# Altium schematic sheet Sheet2.SchDoc
size A3; SheetNumber: 1; SheetTotal: 1; SPICEModelCacheBHSTCHFE: <root> / <DocumentId>BHSTCHFE</DocumentId> / </root>
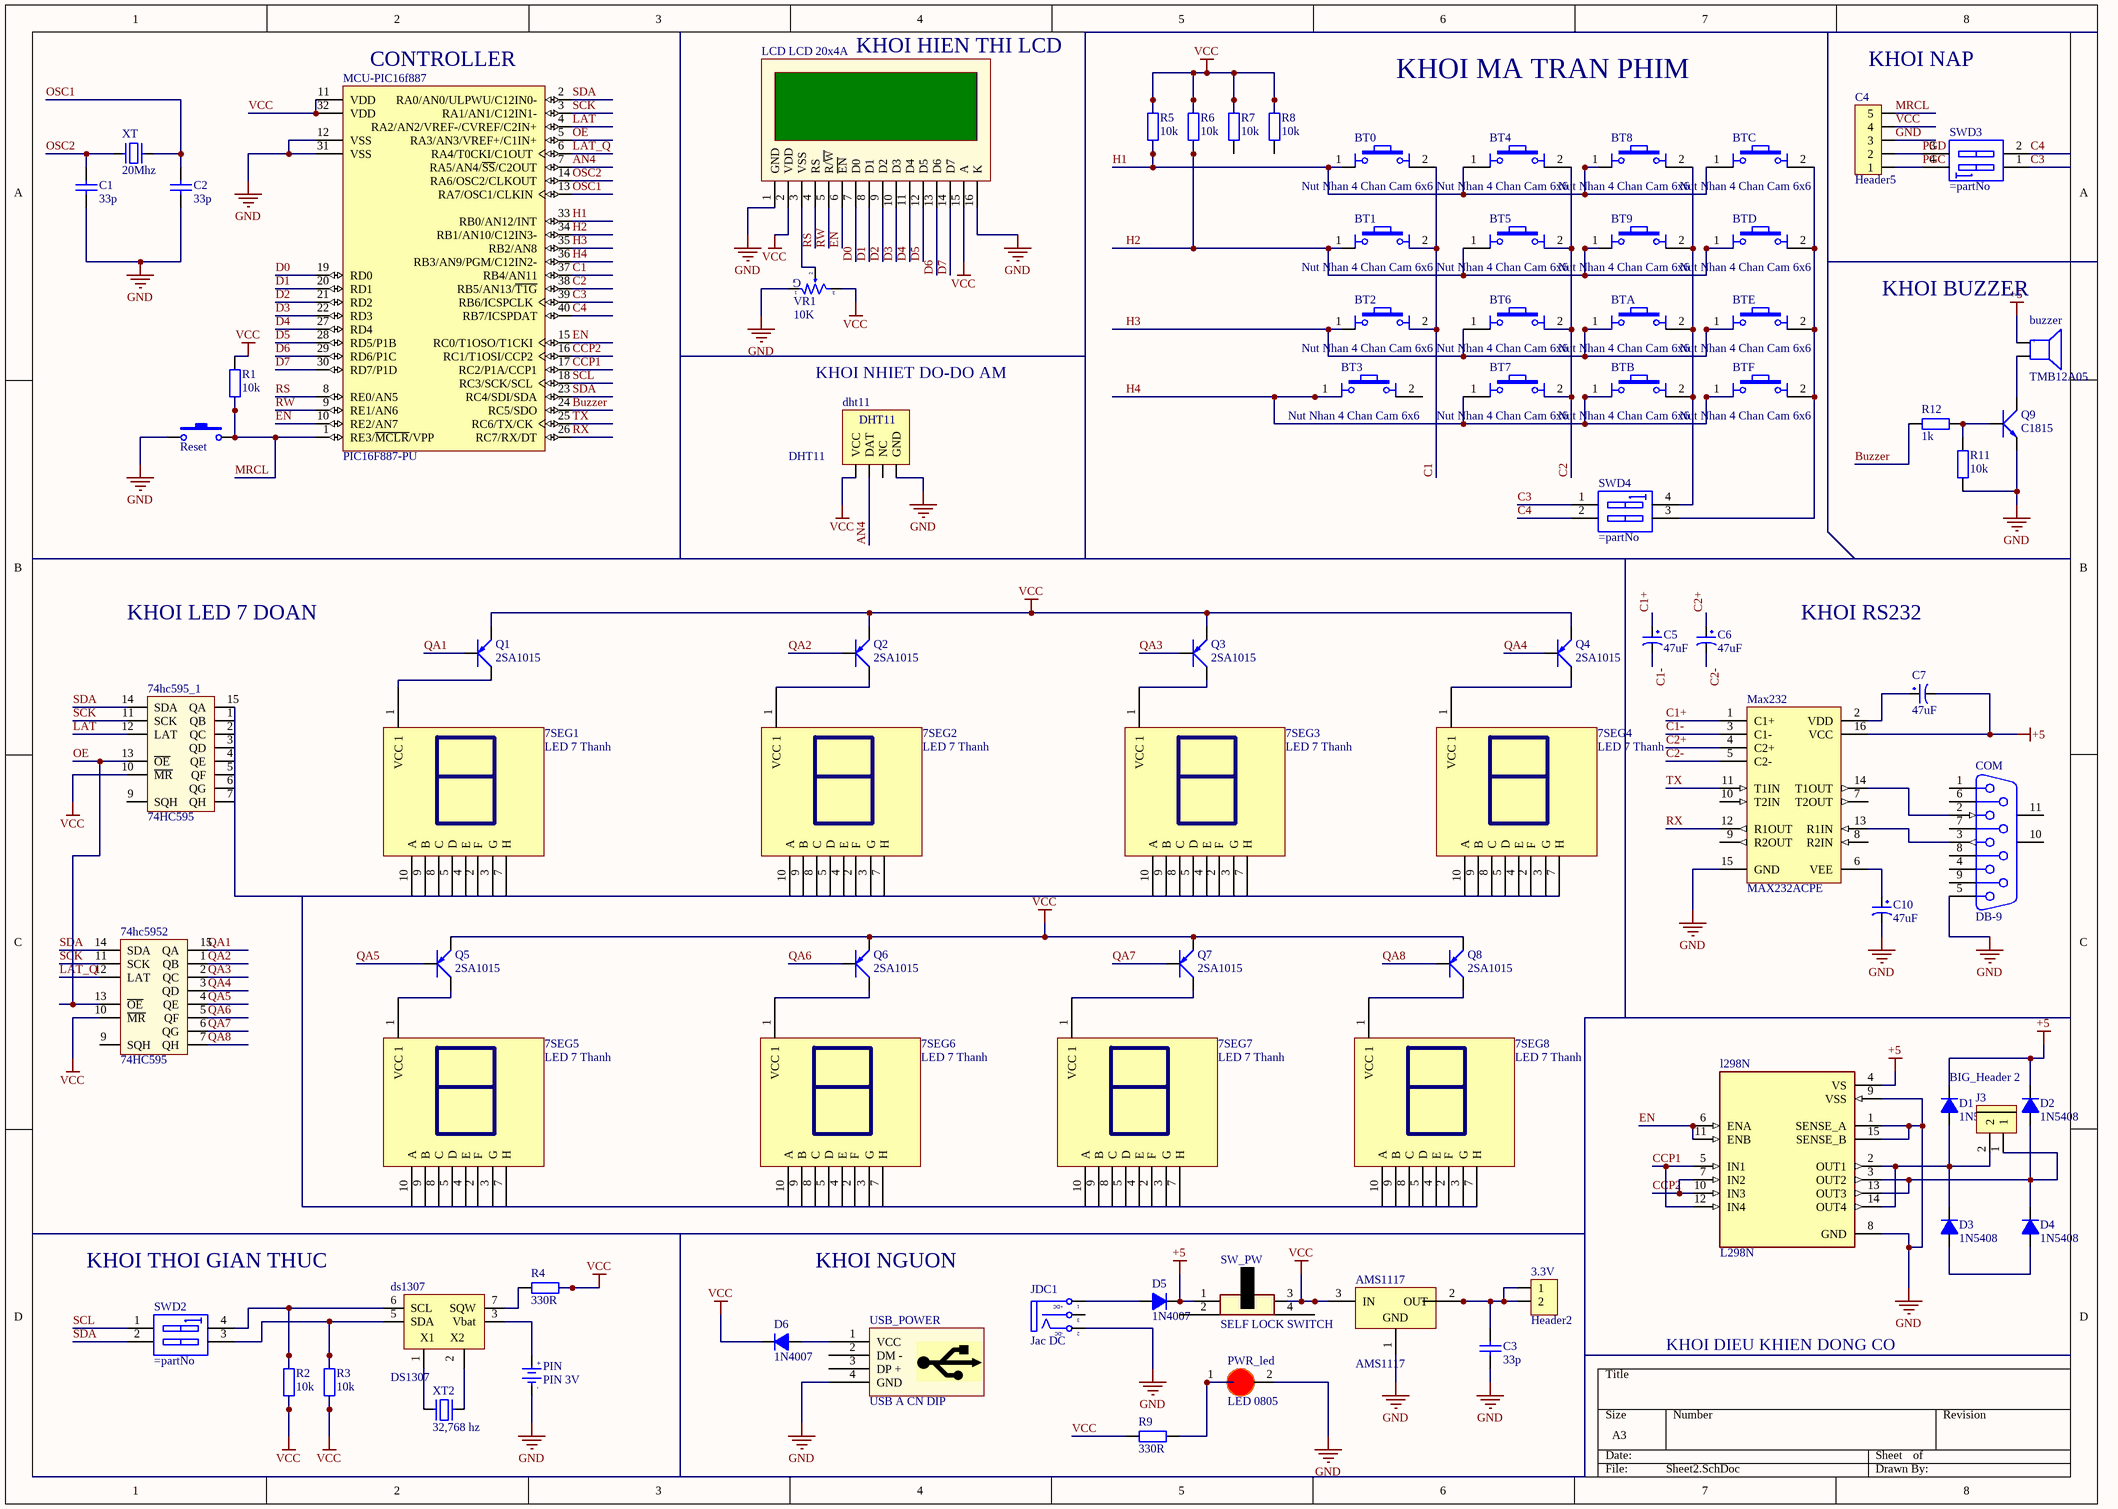
[diagram p0: Sheet2.SchDoc]

## Parts
3.3V  Header2  [HDR2]
7SEG1  LED 7 Thanh  [LED 7x1 0.36]
7SEG2  LED 7 Thanh  [LED 7x1 0.36]
7SEG3  LED 7 Thanh  [LED 7x1 0.36]
7SEG4  LED 7 Thanh  [LED 7x1 0.36]
7SEG5  LED 7 Thanh  [LED 7x1 0.36]
7SEG6  LED 7 Thanh  [LED 7x1 0.36]
7SEG7  LED 7 Thanh  [LED 7x1 0.36]
7SEG8  LED 7 Thanh  [LED 7x1 0.36]
74hc595_1  74HC595  [SO16]
74hc5952  74HC595  [SO16]
AMS1117  AMS1117  [SOT223]
BT0  Nut Nhan 4 Chan Cam 6x6  [Nut Nhan 4 Chan Cam 6x6]
BT1  Nut Nhan 4 Chan Cam 6x6  [Nut Nhan 4 Chan Cam 6x6]
BT2  Nut Nhan 4 Chan Cam 6x6  [Nut Nhan 4 Chan Cam 6x6]
BT3  Nut Nhan 4 Chan Cam 6x6  [Nut Nhan 4 Chan Cam 6x6]
BT4  Nut Nhan 4 Chan Cam 6x6  [Nut Nhan 4 Chan Cam 6x6]
BT5  Nut Nhan 4 Chan Cam 6x6  [Nut Nhan 4 Chan Cam 6x6]
BT6  Nut Nhan 4 Chan Cam 6x6  [Nut Nhan 4 Chan Cam 6x6]
BT7  Nut Nhan 4 Chan Cam 6x6  [Nut Nhan 4 Chan Cam 6x6]
BT8  Nut Nhan 4 Chan Cam 6x6  [Nut Nhan 4 Chan Cam 6x6]
BT9  Nut Nhan 4 Chan Cam 6x6  [Nut Nhan 4 Chan Cam 6x6]
BTA  Nut Nhan 4 Chan Cam 6x6  [Nut Nhan 4 Chan Cam 6x6]
BTB  Nut Nhan 4 Chan Cam 6x6  [Nut Nhan 4 Chan Cam 6x6]
BTC  Nut Nhan 4 Chan Cam 6x6  [Nut Nhan 4 Chan Cam 6x6]
BTD  Nut Nhan 4 Chan Cam 6x6  [Nut Nhan 4 Chan Cam 6x6]
BTE  Nut Nhan 4 Chan Cam 6x6  [Nut Nhan 4 Chan Cam 6x6]
BTF  Nut Nhan 4 Chan Cam 6x6  [Nut Nhan 4 Chan Cam 6x6]
buzzer  TMB12A05  [Speaker]
C1  value 33p  [Tu-pico]  (hidden comment: Capacitor Ceramic)
C2  value 33p  [Tu-pico]  (hidden comment: Capacitor Ceramic)
C3  value 33p  [Tu-pico]  (hidden comment: Capacitor Ceramic)
C4  Header5  [HDR5]
C5  47uF  [tu tantalum smd3216]
C6  47uF  [tu tantalum smd3216]
C7  47uF  [tu tantalum smd3216]
C10  47uF  [tu tantalum smd3216]
COM  DB-9  [DB-9 M]
D1  1N5408  [D5A]
D2  1N5408  [D5A]
D3  1N5408  [D5A]
D4  1N5408  [D5A]
D5  1N4007  [D1A]
D6  1N4007  [D1A]
dht11  DHT11  [DHT11]
ds1307  DS1307  [DIP8]
J3  BIG_Header 2  [BIG_Header 2]
JDC1  Jac DC  [DC-IN]
l298N  L298N  [L298N]
LCD  LCD 20x4A  [LCD20X4A]
Max232  MAX232ACPE  [PE16A]
MCU-PIC16f887  PIC16F887-PU  [DIP40_Socket]
PIN  PIN 3V  [PIN3V]
PWR_led  LED 0805  [LED-0805-Red]
Q1  2SA1015  [SOT23-321]
Q2  2SA1015  [SOT23-321]
Q3  2SA1015  [SOT23-321]
Q4  2SA1015  [SOT23-321]
Q5  2SA1015  [SOT23-321]
Q6  2SA1015  [SOT23-321]
Q7  2SA1015  [SOT23-321]
Q8  2SA1015  [SOT23-321]
Q9  C1815  [TO92]
R1  10k  [tro smd 0603]
R2  10k  [tro smd 0603]
R3  10k  [tro smd 0603]
R4  330R  [tro smd 0603]
R5  10k  [tro smd 0603]
R6  10k  [tro smd 0603]
R7  10k  [tro smd 0603]
R8  10k  [tro smd 0603]
R9  330R  [tro smd 0603]
R11  10k  [tro smd 0603]
R12  1k  [tro smd 0603]
Reset  Nut Nhan 2 Chan SMD 3x6x2.5  [Nut Nhan 2 Chan SMD 3x6x2.5]  (value not drawn)
SW_PW  SELF LOCK SWITCH  [SW_70_31.5D47_TH_ST]
SWD2  (no value)  [SW-DIP2]
SWD3  (no value)  [SW-DIP2]
SWD4  (no value)  [SW-DIP2]
USB_POWER  USB A CN DIP  [USB A CN DIP]
VR1  10K  [VR-S2]
XT  20Mhz  [XT2]
XT2  32,768 hz  [XT32k]

## Nets
+5: buzzer.1(+) C7.2 D1.2(K) D2.2(K) D5.2(K) l298N.4(VS) Max232.16(VCC) SW_PW.1
GND: 74hc595_1.8(GND) 74hc5952.8(GND) AMS1117.1(GND) C1.1 C2.1 C3.1 C4.3 C10.2 COM.5 dht11.4(GND) ds1307.4(GND) JDC1.2(TN) l298N.1(SENSE_A) l298N.8(GND) l298N.9(VSS) l298N.15(SENSE_B) LCD.1(GND) LCD.16(K) Max232.15(GND) MCU-PIC16f887.12(VSS) MCU-PIC16f887.31(VSS) PIN.2(GND) PWR_led.2(K) Q9.1(E) R11.1 Reset.1 USB_POWER.4(GND) VR1.1
VCC: 74hc595_1.10(~{MR}) 74hc595_1.16(VCC) 74hc5952.10(~{MR}) 74hc5952.16(VCC) AMS1117.3(IN) C4.4 D6.2(K) dht11.1(VCC) ds1307.8(VCC) LCD.2(VDD) LCD.15(A) MCU-PIC16f887.11(VDD) MCU-PIC16f887.32(VDD) Q1.1(E) Q2.1(E) Q3.1(E) Q4.1(E) Q5.1(E) Q6.1(E) Q7.1(E) Q8.1(E) R1.2 R2.1 R3.1 R4.2 R5.2 R6.2 R7.2 R8.2 R9.1 SW_PW.3 VR1.3
AN4: dht11.2(DAT) MCU-PIC16f887.7(RA5/AN4/~{SS}/C2OUT)
Buzzer: MCU-PIC16f887.24(RC5/SDO) R12.1
C1: BT0.2 BT1.2 BT2.2 MCU-PIC16f887.37(RB4/AN11)
C1+: C5.1 Max232.1(C1+)
C1-: C5.2 Max232.3(C1-)
C2: BT4.2 BT5.2 BT6.2 BT7.2 MCU-PIC16f887.38(RB5/AN13/~{T1G})
C2+: C6.1 Max232.4(C2+)
C2-: C6.2 Max232.5(C2-)
C3: MCU-PIC16f887.39(RB6/ICSPCLK) SWD3.1 SWD4.1
C4: MCU-PIC16f887.40(RB7/ICSPDAT) SWD3.2 SWD4.2
CCP1: l298N.5(IN1) l298N.12(IN4) MCU-PIC16f887.17(RC2/P1A/CCP1)
CCP2: l298N.7(IN2) l298N.10(IN3) MCU-PIC16f887.16(RC1/T1OSI/CCP2)
D0: LCD.7(D0) MCU-PIC16f887.19(RD0)
D1: LCD.8(D1) MCU-PIC16f887.20(RD1)
D2: LCD.9(D2) MCU-PIC16f887.21(RD2)
D3: LCD.10(D3) MCU-PIC16f887.22(RD3)
D4: LCD.11(D4) MCU-PIC16f887.27(RD4)
D5: LCD.12(D5) MCU-PIC16f887.28(RD5/P1B)
D6: LCD.13(D6) MCU-PIC16f887.29(RD6/P1C)
D7: LCD.14(D7) MCU-PIC16f887.30(RD7/P1D)
EN: l298N.6(ENA) l298N.11(ENB) LCD.6(~{EN}) MCU-PIC16f887.10(RE2/AN7) MCU-PIC16f887.15(RC0/T1OSO/T1CKI)
H1: BT0.1 BT4.1 BT8.1 BTC.1 MCU-PIC16f887.33(RB0/AN12/INT) R5.1
H2: BT1.1 BT5.1 BT9.1 BTD.1 MCU-PIC16f887.34(RB1/AN10/C12IN3-) R6.1
H3: BT2.1 BT6.1 BTA.1 BTE.1 MCU-PIC16f887.35(RB2/AN8)
H4: BT3.1 BT7.1 BTB.1 BTF.1 MCU-PIC16f887.36(RB3/AN9/PGM/C12IN2-)
LAT: 74hc595_1.12(LAT) MCU-PIC16f887.4(RA2/AN2/VREF-/CVREF/C2IN+)
LAT_Q: 74hc5952.12(LAT) MCU-PIC16f887.6(RA4/T0CKI/C1OUT)
MRCL: C4.5 MCU-PIC16f887.1(RE3/~{MCLR}/VPP) R1.1 Reset.2
OE: 74hc595_1.13(~{OE}) 74hc5952.13(~{OE}) MCU-PIC16f887.5(RA3/AN3/VREF+/C1IN+)
OSC1: C2.2 MCU-PIC16f887.13(RA7/OSC1/CLKIN) XT.1
OSC2: C1.2 MCU-PIC16f887.14(RA6/OSC2/CLKOUT) XT.2
PGC: C4.1 SWD3.4
PGD: C4.2 SWD3.3
QA1: 74hc5952.15(QA) Q1.3(B)
QA2: 74hc5952.1(QB) Q2.3(B)
QA3: 74hc5952.2(QC) Q3.3(B)
QA4: 74hc5952.3(QD) Q4.3(B)
QA5: 74hc5952.4(QE) Q5.3(B)
QA6: 74hc5952.5(QF) Q6.3(B)
QA7: 74hc5952.6(QG) Q7.3(B)
QA8: 74hc5952.7(QH) Q8.3(B)
RS: LCD.4(RS) MCU-PIC16f887.8(RE0/AN5)
RW: LCD.5(R/~{W}) MCU-PIC16f887.9(RE1/AN6)
RX: Max232.12(R1OUT) MCU-PIC16f887.26(RC7/RX/DT)
SCK: 74hc595_1.11(SCK) 74hc5952.11(SCK) MCU-PIC16f887.3(RA1/AN1/C12IN1-)
SCL: MCU-PIC16f887.18(RC3/SCK/SCL) SWD2.1
SDA: 74hc595_1.14(SDA) 74hc5952.14(SDA) MCU-PIC16f887.2(RA0/AN0/ULPWU/C12IN0-) MCU-PIC16f887.23(RC4/SDI/SDA) SWD2.2
TX: Max232.11(T1IN) MCU-PIC16f887.25(RC6/TX/CK)
Net3.3V_1: 3.3V.1 3.3V.2 AMS1117.2(OUT) AMS1117.4 C3.2
Net7SEG1_1: 7SEG1.1(VCC_1) Q1.2(C)
Net7SEG2_1: 7SEG2.1(VCC_1) Q2.2(C)
Net7SEG3_1: 7SEG3.1(VCC_1) Q3.2(C)
Net7SEG4_1: 7SEG4.1(VCC_1) Q4.2(C)
Net7SEG5_1: 7SEG5.1(VCC_1) Q5.2(C)
Net7SEG6_1: 7SEG6.1(VCC_1) Q6.2(C)
Net7SEG7_1: 7SEG7.1(VCC_1) Q7.2(C)
Net7SEG8_1: 7SEG8.1(VCC_1) Q8.2(C)
NetBT8_2: BT8.2 BT9.2 BTA.2 BTB.2 SWD4.4
NetBTC_2: BTC.2 BTD.2 BTE.2 BTF.2 SWD4.3
Netbuzzer_2: buzzer.2(-) Q9.2(C)
NetC7_1: C7.1 Max232.2(VDD)
NetC10_1: C10.1 Max232.6(VEE)
NetCOM_2: COM.2 Max232.14(T1OUT)
NetCOM_3: COM.3 Max232.13(R1IN)
NetD1_1: D1.1(A) D3.2(K) J3.2 l298N.2(OUT1) l298N.14(OUT4)
NetD2_1: D2.1(A) D4.2(K) J3.1 l298N.3(OUT2) l298N.13(OUT3)
NetD3_1: D3.1(A) D4.1(A)
NetD5_1: D5.1(A) JDC1.1(T)
NetD6_1: D6.1(A) USB_POWER.1(VCC)
Netds1307_1: ds1307.1(X1) XT2.1
Netds1307_2: ds1307.2(X2) XT2.2
Netds1307_3: ds1307.3(Vbat) PIN.1(+3V)
Netds1307_5: ds1307.5(SDA) R3.2 SWD2.3
Netds1307_6: ds1307.6(SCL) R2.2 SWD2.4
Netds1307_7: ds1307.7(SQW) R4.1
NetLCD_3: LCD.3(VSS) VR1.2
NetPWR_led_1: PWR_led.1(A) R9.2
NetQ9_3: Q9.3(B) R11.2 R12.2

Not connected (* = marked no-connect by the designer): 7SEG1 2(F) 3(G) 4(E) 5(D) 7(H) 8(C) 9(B) 10(A); 7SEG2 2(F) 3(G) 4(E) 5(D) 7(H) 8(C) 9(B) 10(A); 7SEG3 2(F) 3(G) 4(E) 5(D) 7(H) 8(C) 9(B) 10(A); 7SEG4 2(F) 3(G) 4(E) 5(D) 7(H) 8(C) 9(B) 10(A); 7SEG5 2(F) 3(G) 4(E) 5(D) 7(H) 8(C) 9(B) 10(A); 7SEG6 2(F) 3(G) 4(E) 5(D) 7(H) 8(C) 9(B) 10(A); 7SEG7 2(F) 3(G) 4(E) 5(D) 7(H) 8(C) 9(B) 10(A); 7SEG8 2(F) 3(G) 4(E) 5(D) 7(H) 8(C) 9(B) 10(A); 74hc595_1 1(QB) 2(QC) 3(QD) 4(QE) 5(QF) 6(QG) 7(QH) 9(SQH) 15(QA); 74hc5952 9(SQH); BT3 2; COM 1 4 6 7 8 9 10(MH1) 11(MH2); dht11 3(NC); JDC1 3(S); Max232 7(T2OUT) 8(R2IN) 9(R2OUT) 10(T2IN); R7 1; R8 1; SW_PW 2 4; USB_POWER 2(DM_-) 3(DP_+)

## Buses and harness runs
bus 

## Notes on the sheet
- (near MCU-PIC16f887) CONTROLLER
- KHOI HIEN THI LCD
- KHOI MA TRAN PHIM
- (near C4) KHOI NAP
- (near buzzer) KHOI BUZZER
- KHOI NHIET DO-DO AM
- KHOI LED 7 DOAN
- KHOI RS232
- KHOI THOI GIAN THUC
- KHOI NGUON
- KHOI DIEU KHIEN DONG CO
- (in symbol DCIN) +DC; -DC
- (in symbol PIN 3V) +; -
- (in symbol VR-S) G

## Library data of the parts
3.3V = Header2: Header IDC, 2 x 1 Pin Vertical 2.54mm Pitch (Non-Boxed, Male); Manufacturer: W¨¹rth Elektronik eiSos GmbH; partNo: 613002143121; ComponentLink1 Description: Manufacturer; ComponentLink2 Description: Datasheet; NoPins: 02; Created Date: 29 March 2013; ComponentLink1URL: http://www.we-online.com; ComponentLink2URL: http://katalog.we-online.de/em/datasheet/6130xx143121.pdf; Created by: Karrer Zheng
7SEG1-7SEG8 = LED 7x1 0.36 Anot: Dán; Don_Vi: Con; Ma_Hang: MH001607; Ten_Linh_Kien: Led 7 0.36 1 Số Anot (Sáng Đỏ); Ghi_Chu: *; Kieu_Chan: *; Chung_Loai: Dán
74hc595_1 74hc5952 = 74595: 8 Bit Serial input - Parallel Output; Value: 74HC595
AMS1117 = AMS117
BT0-BT9 BTA BTB BTC BTD BTE BTF = Nut Nhan 4 Chan Cam 6x6: Nut Nhan 4 Chan 6x6mm; Ten: Nút Nhấn 4 Chân 6x6x5MM DIP; Ma_Hang: MH004584
buzzer = Buzz: Buzzer >= 80dB, 5V
C1-C3 = CapCeramic: Capacitor; Published: 8-Jun-2000; LatestRevisionDate: 17-Jul-2002; LatestRevisionNote: Re-released for DXP Platform.; PackageReference: RAD-0.3; Publisher: Altium Limited
C4 = Header5: Header IDC, 5 x 1 Pin Vertical 2.54mm Pitch (Non-Boxed, Male); Manufacturer: W¨¹rth Elektronik eiSos GmbH; partNo: 613002143121; ComponentLink1 Description: Manufacturer; ComponentLink2 Description: Datasheet; NoPins: 02; Created Date: 29 March 2013; ComponentLink1URL: http://www.we-online.com; ComponentLink2URL: http://katalog.we-online.de/em/datasheet/6130xx143121.pdf; Created by: Karrer Zheng
C5-C7 C10 = Tu tantalum 47uF 10V SMD3216: Dán; Don_Vi: Con; So_Chan: 2; Ten_Linh_Kien: Tụ tantalum 476A-47uF 10V SMD3216; Ma_Hang: MH007497; Chung_Loai: Dán; Kieu_Chan: *
COM = COM 9
D1-D4 = D5A: Diode 5A; Value: 1N5408
D5 D6 = D1A: Diode 1A; Value: 1N4007
dht11 = DHT11: Manufacturer: W¨¹rth Elektronik eiSos GmbH; partNo: 613004143121; ComponentLink1 Description: Manufacturer; ComponentLink2 Description: Datasheet; NoPins: 04; Created Date: 29 March 2013; ComponentLink1URL: http://www.we-online.com; ComponentLink2URL: http://katalog.we-online.de/em/datasheet/6130xx143121.pdf; Created by: Karrer Zheng
ds1307 = DS1307: Real Timer Serial; Value: DS1307
JDC1 = DCIN: Jac DC input; Value: Jac DC
l298N = L298N: Half Bridge _4_ Driver DC Motors, Relays, Solenoids, Stepper Motors Bipolar 15-Multiwatt; MF: STMicroelectronics; MP: L298N; Package: Multiwatt-15 STMicroelectronics; Price: None; Availability: Unavailable; Value: *; SnapEDA_Link: https://www.snapeda.com/parts/L298N/STMicroelectronics/view-part/294022/?ref=snap
LCD = LCD20x4A: LCD dipslay 20 char, 4 line; Value: Jum 40; Value: LCD 20x4A
Max232 = MAX232ACPE: +5V Powered, Multi-Channel RS-232 Driver/Receiver; Published: 16-Jan-2001; LatestRevisionDate: 29-May-2009; LatestRevisionNote: Component Body Added.; PackageVersion: 1997; PackageReference: PE16A; Publisher: Altium Limited; PackageDescription: DIP, 16-Pin, Row Spacing 7.62 mm, Pitch 2.54 mm; Code_JEDEC: MS-001-BB; ComponentLink1Description: Manufacturer Link; ComponentLink1URL: http://www.maxim-ic.com/; ComponentLink2Description: Datasheet; ComponentLink2URL: http://pdfserv.maxim-ic.com/en/ds/MAX220-MAX249.pdf
MCU-PIC16f887 = PIC16F887-PU: Flash-Based, 8-Bit CMOS Microcontroller with nanoWatt Technology, 8K (x14-Bit words) Program Memory, 624 Bytes Data Memory, 35 I/O pins, 40-Pin PDIP, Standard VDD Range, Extended Temperature; Published: 29-Jan-2009; LatestRevisionDate: 02-Dec-2009; LatestRevisionNote: Updated datasheet to version revF, Apr-2009.; DatasheetVersion: revF, Apr-2009; PackageVersion: revBB, Aug-2009; PackageReference: PDIP600-P40; Publisher: Altium Limited; PackageDescription: 40-Lead Plastic Dual In-Line (P) - 600 mil Body [PDIP]; Supplier 1: Digi-Key; Supplier Part Number 1: PIC16F887-E/P-ND; Supplier 2: Farnell; Supplier Part Number 2: 1703423; ComponentLink1Description: Datasheet; ComponentLink1URL: http://ww1.microchip.com/downloads/en/DeviceDoc/41291F.pdf; ComponentLink2Description: Packaging Specification; ComponentLink2URL: http://www.microchip.com/stellent/groups/techpub_sg/documents/packagingspec/en012702.pdf; ComponentLink3Description: Microchip.com Home; ComponentLink3URL: http://www.microchip.com/
PIN = PIN 3V: Battery 3VDC; Value: PIN 3V
PWR_led = LED 0805 Do: Dán; Don_Vi: Con; Ma_Hang: MH000897; Ten_Linh_Kien: LED 0805 Màu Đỏ (Red); Ghi_Chu: *; Kieu_Chan: *; Chung_Loai: Dán
Q1-Q8 = 2SA1015: PNP 600mW, ECB; Value: A1015
Q9 = Trans C1815 DIP: NPN transistor; Value: C9014
R1-R3 R5-R8 R11 = Tro 0603 5% 10k: Dán; Don_Vi: Con; So_Chan: 2; Ten_Linh_Kien: Trở 0603 5% 10k; Ma_Hang: MH006316; Chung_Loai: Dán; Kieu_Chan: *
R4 R9 = Tro 0603 5% 330R: Dán; Don_Vi: Con; Ma_Hang: MH006910; So_Chan: 2; Ten_Linh_Kien: Trở 0603 5% 330R; Chung_Loai: Dán; Kieu_Chan: *
R12 = Tro 0603 1% 1k: Dán; So_Chan: 2; Don_Vi: Con; Ten_Linh_Kien: Trở 0603 1% 1k; Ma_Hang: MH006334; Chung_Loai: Dán; Kieu_Chan: *
Reset = Nut Nhan 2 Chan SMD 3x6x2.5: Ma_Hang: MH001036; Ten: Nút Nhấn 2 Chân 3x6x2.5MM SMD
SW_PW = SW1_LOCAL-TH: 6 Pin DPDT Mini Push Button Self-locking Switch Multimeter Switch; Manufacturer Part Number: NA; Case/Package: TH; Manufacturer: NA; Supplier-1: SP ROAD; Supplier Part Number-1: NA; Alternate Part Number-1: NA
SWD2-SWD4 = SWDIP2: WS-DITV 2.54 mm small compact THT flat actuator with top tape; Manufacturer: Wurth Elektronik; Part No.: 418127160902; ComponentLink1 Description: Manufacturer; ComponentLink2 Description: Datasheet; Pole: 02; Created Date: Dec.2015; ComponentLink1URL: http://www.we-online.com; ComponentLink2URL: http://katalog.we-online.de/em/datasheet/4181271609xx.pdf; Created by: Baojun Chen
USB_POWER = USB A CN DIP: USB Type A; Ten: USB A Cái DIP; Ma_Hang: MH000941
VR1 = VR-S: Var Resistor; Value: Volume 50k
XT = XT2: Crystal For all Crystal 2pin.; Value: 4Mhz
XT2 = XT32k: Crystal 32,768kHz for timer real; Value: 32,768khz